# Altium schematic sheet DIAGRAM.SchDoc
size A3; SheetNumber: 1; SheetTotal: 8
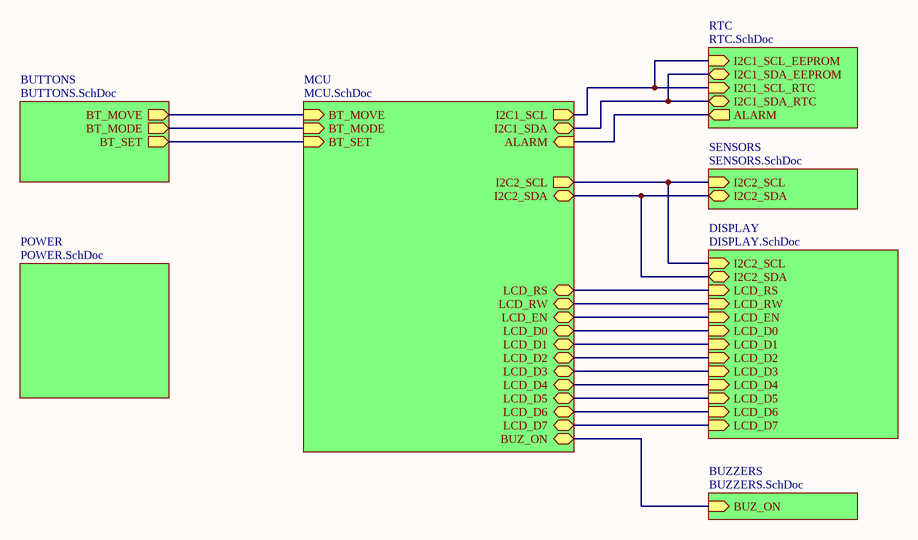
[diagram p0: DIAGRAM.SchDoc]

## Sub-sheets
BUTTONS = BUTTONS.SchDoc: BT_MOVE (out), BT_MODE (out), BT_SET (out)
BUZZERS = BUZZERS.SchDoc: BUZ_ON (in)
DISPLAY = DISPLAY.SchDoc: LCD_RS (in), LCD_RW (in), LCD_EN (in), LCD_D1 (in), LCD_D2 (in), LCD_D3 (in), LCD_D4 (in), LCD_D5 (in), LCD_D6 (in), LCD_D7 (in), I2C2_SCL (in), I2C2_SDA (bidir), LCD_D0 (in)
MCU = MCU.SchDoc: LCD_RS (bidir), LCD_RW (bidir), LCD_EN (bidir), LCD_D1 (bidir), LCD_D2 (bidir), LCD_D3 (bidir), LCD_D4 (bidir), LCD_D5 (bidir), LCD_D6 (bidir), LCD_D7 (bidir), LCD_D0 (bidir), BT_MOVE (in), BT_MODE (in), BT_SET (in), I2C2_SCL (out), I2C2_SDA (bidir), I2C1_SCL (out), I2C1_SDA (bidir), ALARM (in), BUZ_ON (bidir)
POWER = POWER.SchDoc: no entries
RTC = RTC.SchDoc: I2C1_SCL_RTC (in), I2C1_SDA_RTC (bidir), ALARM (out), I2C1_SCL_EEPROM (in), I2C1_SDA_EEPROM (bidir)
SENSORS = SENSORS.SchDoc: I2C2_SCL (in), I2C2_SDA (bidir)

## Nets
(unnamed): sheet DISPLAY/LCD_RS, sheet MCU/LCD_RS
(unnamed): sheet DISPLAY/LCD_RW, sheet MCU/LCD_RW
(unnamed): sheet DISPLAY/LCD_EN, sheet MCU/LCD_EN
(unnamed): sheet DISPLAY/LCD_D1, sheet MCU/LCD_D1
(unnamed): sheet DISPLAY/LCD_D2, sheet MCU/LCD_D2
(unnamed): sheet DISPLAY/LCD_D3, sheet MCU/LCD_D3
(unnamed): sheet DISPLAY/LCD_D4, sheet MCU/LCD_D4
(unnamed): sheet DISPLAY/LCD_D5, sheet MCU/LCD_D5
(unnamed): sheet DISPLAY/LCD_D6, sheet MCU/LCD_D6
(unnamed): sheet DISPLAY/LCD_D7, sheet MCU/LCD_D7
(unnamed): sheet DISPLAY/I2C2_SCL, sheet SENSORS/I2C2_SCL, sheet MCU/I2C2_SCL
(unnamed): sheet DISPLAY/I2C2_SDA, sheet SENSORS/I2C2_SDA, sheet MCU/I2C2_SDA
(unnamed): sheet DISPLAY/LCD_D0, sheet MCU/LCD_D0
(unnamed): sheet BUTTONS/BT_MOVE, sheet MCU/BT_MOVE
(unnamed): sheet BUTTONS/BT_MODE, sheet MCU/BT_MODE
(unnamed): sheet BUTTONS/BT_SET, sheet MCU/BT_SET
(unnamed): sheet RTC/I2C1_SCL_RTC, sheet RTC/I2C1_SCL_EEPROM, sheet MCU/I2C1_SCL
(unnamed): sheet RTC/I2C1_SDA_RTC, sheet RTC/I2C1_SDA_EEPROM, sheet MCU/I2C1_SDA
(unnamed): sheet RTC/ALARM, sheet MCU/ALARM
(unnamed): sheet MCU/BUZ_ON, sheet BUZZERS/BUZ_ON